# EAGLE design output_stage (EAGLE 6.5.0)
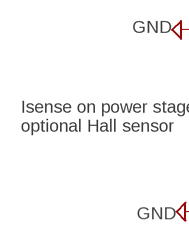
[diagram p0: schematic, sheet 1, part 1 of 2]
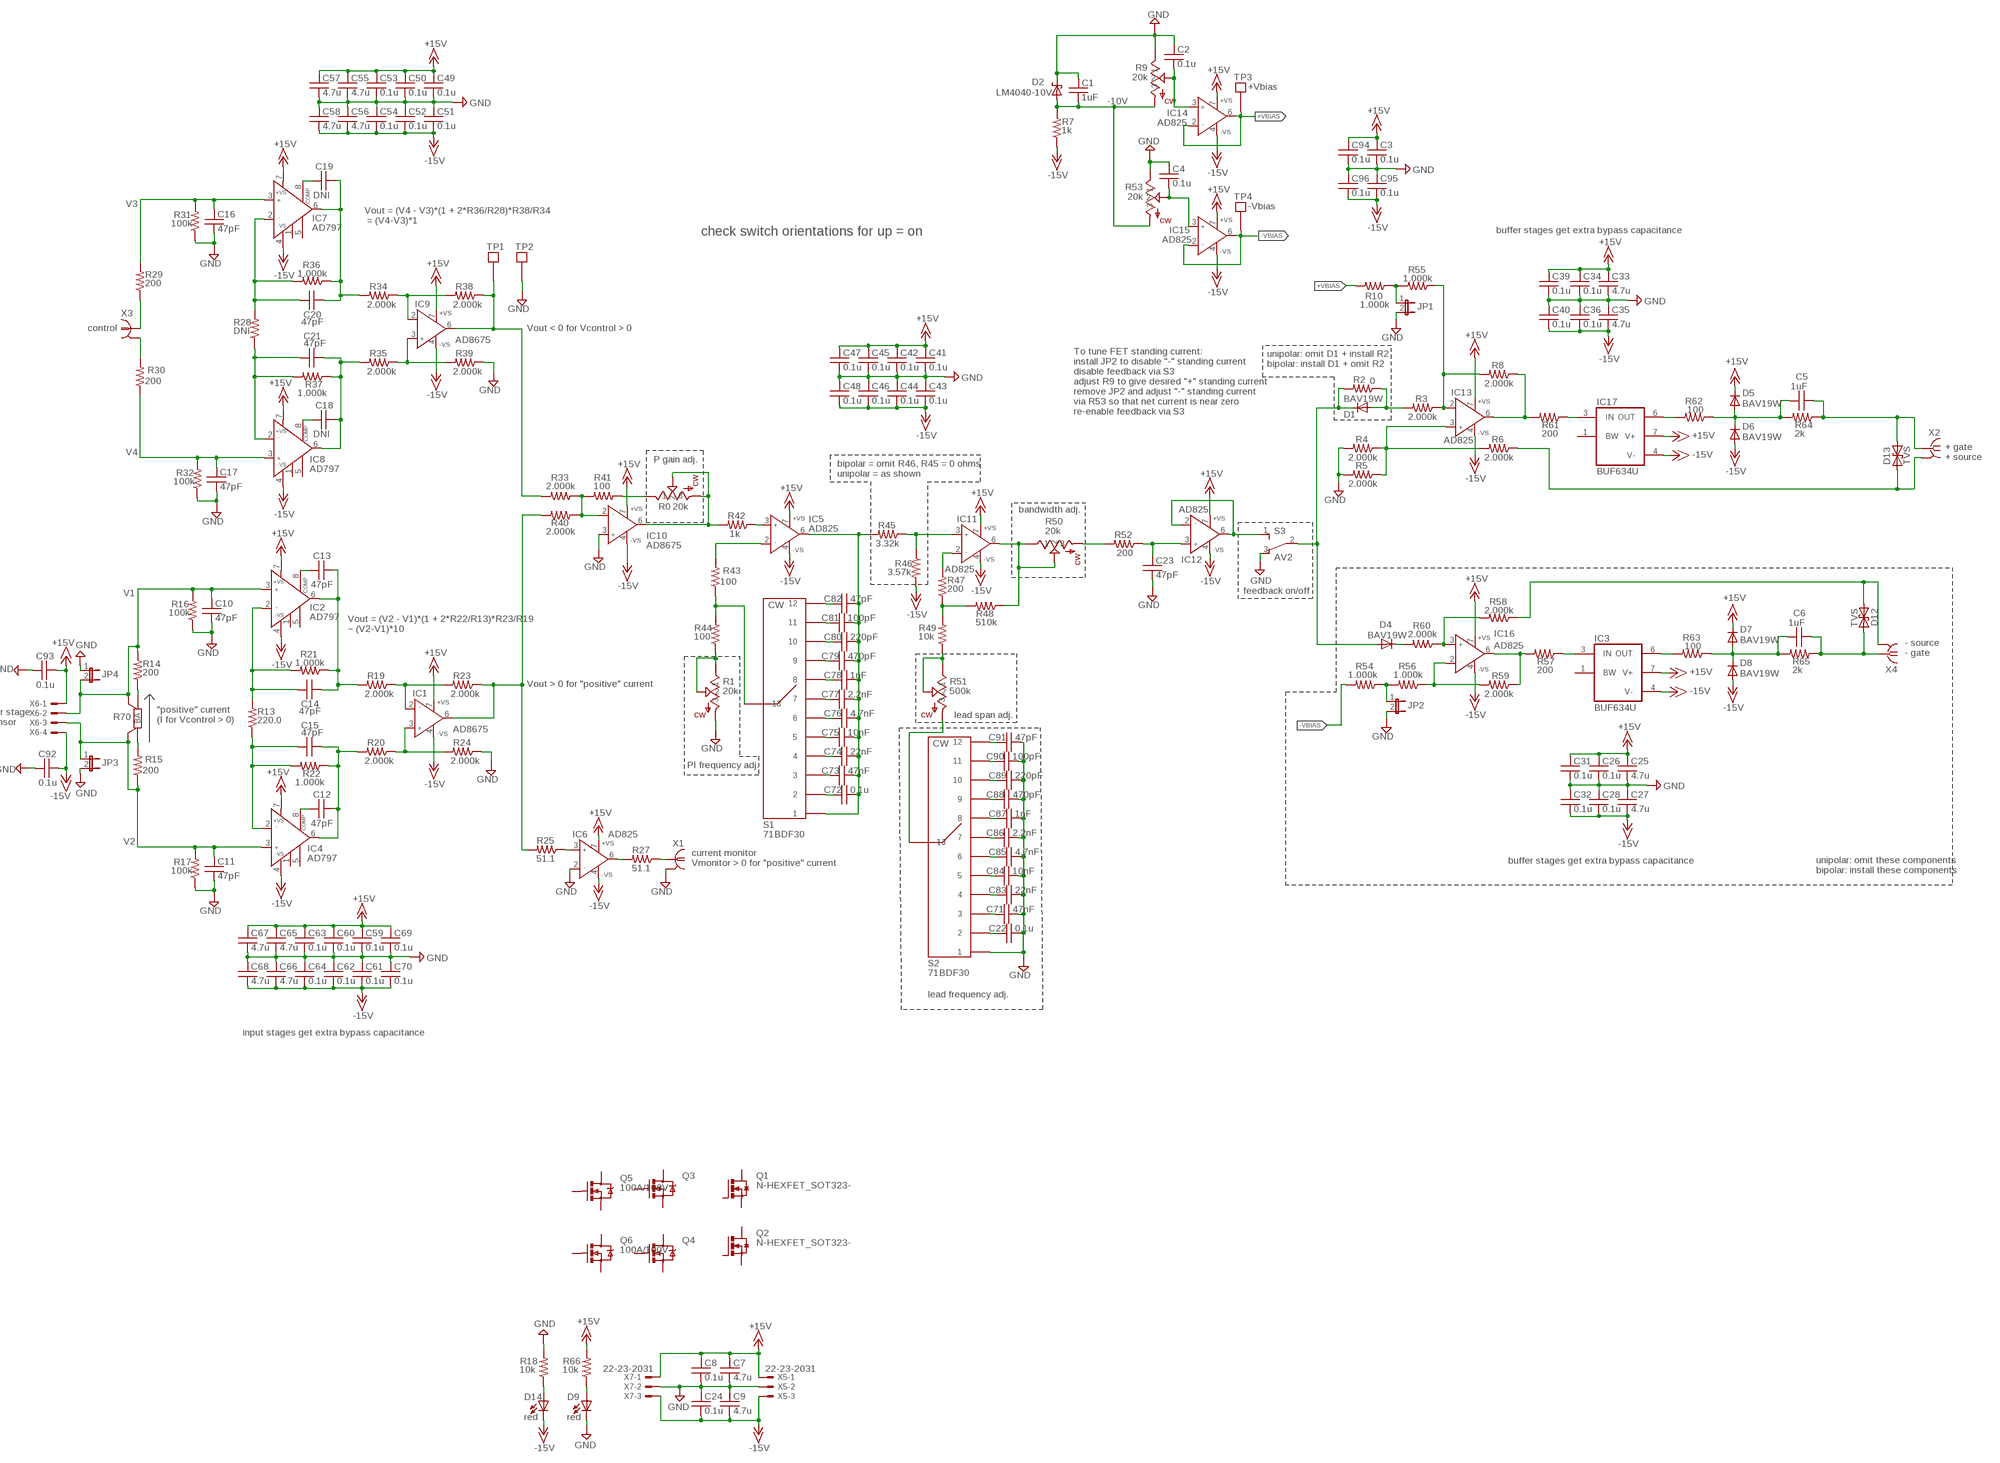
[diagram p1: schematic, sheet 1, part 2 of 2]

## Parts
C1  1uF  C0603  [0603]
C2  0.1u  C0603  [0603]
C3  0.1u  C0603  [0603]
C4  0.1u  C0603  [0603]
C5  1uF  C0603  [0603]
C6  1uF  C0603  [0603]
C7  4.7u  C0603  [0603]
C8  0.1u  C0603  [0603]
C9  4.7u  C0603  [0603]
C10  47pF  C0603  [0603]
C11  47pF  C0603  [0603]
C12  47pF  C0603  [0603]
C13  47pF  C0603  [0603]
C14  47pF  C0603  [0603]
C15  47pF  C0603  [0603]
C16  47pF  C0603  [0603]
C17  47pF  C0603  [0603]
C18  DNI  C0603  [0603]
C19  DNI  C0603  [0603]
C20  47pF  C0603  [0603]
C21  47pF  C0603  [0603]
C22  0.1u  C0603  [0603]
C23  47pF  C0603  [0603]
C24  0.1u  C0603  [0603]
C25  4.7u  C0603  [0603]
C26  0.1u  C0603  [0603]
C27  4.7u  C0603  [0603]
C28  0.1u  C0603  [0603]
C31  0.1u  C0603  [0603]
C32  0.1u  C0603  [0603]
C33  4.7u  C0603  [0603]
C34  0.1u  C0603  [0603]
C35  4.7u  C0603  [0603]
C36  0.1u  C0603  [0603]
C39  0.1u  C0603  [0603]
C40  0.1u  C0603  [0603]
C41  0.1u  C0603  [0603]
C42  0.1u  C0603  [0603]
C43  0.1u  C0603  [0603]
C44  0.1u  C0603  [0603]
C45  0.1u  C0603  [0603]
C46  0.1u  C0603  [0603]
C47  0.1u  C0603  [0603]
C48  0.1u  C0603  [0603]
C49  0.1u  C0603  [0603]
C50  0.1u  C0603  [0603]
C51  0.1u  C0603  [0603]
C52  0.1u  C0603  [0603]
C53  0.1u  C0603  [0603]
C54  0.1u  C0603  [0603]
C55  4.7u  C0603  [0603]
C56  4.7u  C0603  [0603]
C57  4.7u  C0603  [0603]
C58  4.7u  C0603  [0603]
C59  0.1u  C0603  [0603]
C60  0.1u  C0603  [0603]
C61  0.1u  C0603  [0603]
C62  0.1u  C0603  [0603]
C63  0.1u  C0603  [0603]
C64  0.1u  C0603  [0603]
C65  4.7u  C0603  [0603]
C66  4.7u  C0603  [0603]
C67  4.7u  C0603  [0603]
C68  4.7u  C0603  [0603]
C69  0.1u  C0603  [0603]
C70  0.1u  C0603  [0603]
C71  47nF  C0603  [0603]
C72  0.1u  C0603  [0603]
C73  47nF  C0603  [0603]
C74  22nF  C0603  [0603]
C75  10nF  C0603  [0603]
C76  4.7nF  C0603  [0603]
C77  2.2nF  C0603  [0603]
C78  1nF  C0603  [0603]
C79  470pF  C0603  [0603]
C80  220pF  C0603  [0603]
C81  100pF  C0603  [0603]
C82  47pF  C0603  [0603]
C83  22nF  C0603  [0603]
C84  10nF  C0603  [0603]
C85  4.7nF  C0603  [0603]
C86  2.2nF  C0603  [0603]
C87  1nF  C0603  [0603]
C88  470pF  C0603  [0603]
C89  220pF  C0603  [0603]
C90  100pF  C0603  [0603]
C91  47pF  C0603  [0603]
C92  0.1u  C0603  [0603]
C93  0.1u  C0603  [0603]
C94  0.1u  C0603  [0603]
C95  0.1u  C0603  [0603]
C96  0.1u  C0603  [0603]
D1  BAV19W  DIODE-SOD123  [SOD123]
D2  LM4040-10V  LM4040  [SOT23]
D4  BAV19W  DIODE-SOD123  [SOD123]
D5  BAV19W  DIODE-SOD123  [SOD123]
D6  BAV19W  DIODE-SOD123  [SOD123]
D7  BAV19W  DIODE-SOD123  [SOD123]
D8  BAV19W  DIODE-SOD123  [SOD123]
D9  red  LED0603  [LED0603]
D12  TVS  [SMA-DIODE]
D13  TVS  [SMA-DIODE]
D14  red  LED0603  [LED0603]
IC1  AD8675  AD825_BR  [SO8]
IC2  AD797  AD797_AR  [SO8]
IC3  BUF634U  [SO08]
IC4  AD797  AD797_BR  [SO8]
IC5  AD825  AD825_A  [SO08]
IC6  AD825  AD825_A  [SO08]
IC7  AD797  AD797_AR  [SO8]
IC8  AD797  AD797_BR  [SO8]
IC9  AD8675  AD825_BR  [SO8]
IC10  AD8675  AD825_BR  [SO8]
IC11  AD825  AD825_A  [SO08]
IC12  AD825  AD825_BR  [SO8]
IC13  AD825  AD825_BR  [SO8]
IC14  AD825  AD825_A  [SO08]
IC15  AD825  AD825_A  [SO08]
IC16  AD825  AD825_A  [SO08]
IC17  BUF634U  [SO08]
JP1  JP1E  [JP1]
JP2  JP1E  [JP1]
JP3  JP1E  [JP1]
JP4  JP1E  [JP1]
Q1  N-HEXFET_SOT323-  [SOT223]
Q2  N-HEXFET_SOT323-  [SOT223]
Q3  MOSFET-NCHANNELFDD8780  [DPAK]
Q4  MOSFET-NCHANNELFDD8780  [DPAK]
Q5  100A/100V  MOSFET-NCHANNELPSMN7R0  [TO-263/D2PAK]
Q6  100A/100V  MOSFET-NCHANNELPSMN7R0  [TO-263/D2PAK]
R0  20k  POT  [3590]
R1  20k  TRIM_US-B90P  [SP19L]
R2  0  R0603  [0603]
R3  2.000k  R0603  [0603]
R4  2.000k  R0603  [0603]
R5  2.000k  R0603  [0603]
R6  2.000k  R0603  [0603]
R7  1k  R0603  [0603]
R8  2.000k  R0603  [0603]
R9  20k  TRIM_US-B90P  [SP19L]
R10  1.000k  R0603  [0603]
R13  220.0  R0603  [0603]
R14  200  R0603  [0603]
R15  200  R0603  [0603]
R16  100k  R0603  [0603]
R17  100k  R0603  [0603]
R18  10k  R0603  [0603]
R19  2.000k  R0603  [0603]
R20  2.000k  R0603  [0603]
R21  1.000k  R0603  [0603]
R22  1.000k  R0603  [0603]
R23  2.000k  R0603  [0603]
R24  2.000k  R0603  [0603]
R25  51.1  R0603  [0603]
R27  51.1  R0603  [0603]
R28  DNI  R0603  [0603]
R29  200  R0603  [0603]
R30  200  R0603  [0603]
R31  100k  R0603  [0603]
R32  100k  R0603  [0603]
R33  2.000k  R0603  [0603]
R34  2.000k  R0603  [0603]
R35  2.000k  R0603  [0603]
R36  1.000k  R0603  [0603]
R37  1.000k  R0603  [0603]
R38  2.000k  R0603  [0603]
R39  2.000k  R0603  [0603]
R40  2.000k  R0603  [0603]
R41  100  R0603  [0603]
R42  1k  R0603  [0603]
R43  100  R0603  [0603]
R44  100  R0603  [0603]
R45  3.32k  R0603  [0603]
R46  3.57k  R0603  [0603]
R47  200  R0603  [0603]
R48  510k  R0603  [0603]
R49  10k  R0603  [0603]
R50  20k  TRIM_US-B90P  [SP19L]
R51  500k  TRIM_US-B90P  [SP19L]
R52  200  R0603  [0603]
R53  20k  TRIM_US-B90P  [SP19L]
R54  1.000k  R0603  [0603]
R55  1.000k  R0603  [0603]
R56  1.000k  R0603  [0603]
R57  200  R0603  [0603]
R58  2.000k  R0603  [0603]
R59  2.000k  R0603  [0603]
R60  2.000k  R0603  [0603]
R61  200  R0603  [0603]
R62  100  R0603  [0603]
R63  100  R0603  [0603]
R64  2k  R0603  [0603]
R65  2k  R0603  [0603]
R66  10k  R0603  [0603]
R70  RSENSE  [22-23-2041]
S1  71BDF30  [71BDF]
S2  71BDF30  [71BDF]
S3  AV2  SPDT  [SPDT-AV2]
TP1  TESTPOINT  [TESTPOINT]
TP2  TESTPOINT  [TESTPOINT]
TP3  TESTPOINT  [TESTPOINT]
TP4  TESTPOINT  [TESTPOINT]
X1  1-227161-0  [AMP_227161]
X2  BU-SMA-H  [BU-SMA-H]
X3  1-227161-0  [AMP_227161]
X4  BU-SMA-H  [BU-SMA-H]
X5  22-23-2031  [22-23-2031]
X6  22-23-2041  [22-23-2041]
X7  22-23-2031  [22-23-2031]

## Nets
+15V: C3.1 C7.1 C8.1 C25.1 C26.1 C31.1 C33.1 C34.1 C39.1 C41.1 C42.1 C45.1 C47.1 C49.1 C50.1 C53.1 C55.1 C57.1 C59.1 C60.1 C63.1 C65.1 C67.1 C69.1 C93.2 C94.1 D5.C D7.C IC1.7(+VS) IC2.7(+VS) IC3.7(V+) IC4.7(+VS) IC5.7(+VS) IC6.7(+VS) IC7.7(+VS) IC8.7(+VS) IC9.7(+VS) IC10.7(+VS) IC11.7(+VS) IC12.7(+VS) IC13.7(+VS) IC14.7(+VS) IC15.7(+VS) IC16.7(+VS) IC17.7(V+) R66.2 X5.1 X6.1 X7.1
+GATE: C5.2 D13.C R64.1 X2.1
+SOURCE: D13.A R6.1 X2.2 X2.3 X2.4 X2.5
+VBIAS: IC14.2(IN-) IC14.6(OUT) R10.2 TP3.P$1
-10V: C1.2 D2.2(A) R7.2 R9.E R53.E
-15V: C9.2 C24.2 C27.2 C28.2 C32.2 C35.2 C36.2 C40.2 C43.2 C44.2 C46.2 C48.2 C51.2 C52.2 C54.2 C56.2 C58.2 C61.2 C62.2 C64.2 C66.2 C68.2 C70.2 C92.2 C95.2 C96.2 D6.A D8.A D14.C IC1.4(-VS) IC2.4(-VS) IC3.4(V-) IC4.4(-VS) IC5.4(-VS) IC6.4(-VS) IC7.4(-VS) IC8.4(-VS) IC9.4(-VS) IC10.4(-VS) IC11.4(-VS) IC12.4(-VS) IC13.4(-VS) IC14.4(-VS) IC15.4(-VS) IC16.4(-VS) IC17.4(V-) R7.1 R46.2 X5.3 X6.4 X7.3
-GATE: C6.2 D12.C R65.1 X4.1
-SOURCE: D12.A R58.1 X4.2 X4.3 X4.4 X4.5
-VBIAS: IC15.2(IN-) IC15.6(OUT) R54.2 TP4.P$1
GND: C1.1 C2.1 C3.2 C4.1 C7.2 C8.2 C9.1 C10.2 C11.2 C16.2 C17.2 C22.2 C23.2 C24.1 C25.2 C26.2 C27.1 C28.1 C31.2 C32.1 C33.2 C34.2 C35.1 C36.1 C39.2 C40.1 C41.2 C42.2 C43.1 C44.1 C45.2 C46.1 C47.2 C48.1 C49.2 C50.2 C51.1 C52.1 C53.2 C54.1 C55.2 C56.1 C57.2 C58.1 C59.2 C60.2 C61.1 C62.1 C63.2 C64.1 C65.2 C66.1 C67.2 C68.1 C69.2 C70.1 C71.2 C83.2 C84.2 C85.2 C86.2 C87.2 C88.2 C89.2 C90.2 C91.2 C92.1 C93.1 C94.2 C95.1 C96.1 D2.1(C) D9.C IC6.2(IN-) IC10.3(IN+) JP1.2 JP2.2 JP3.2 JP4.1 R1.E R4.2 R5.2 R9.A R16.1 R17.1 R18.2 R24.1 R31.1 R32.1 R39.1 R53.A S2.1 S3.3 TP2.P$1 X1.2 X5.2 X7.2
N$1: R1.A R1.S R44.1
N$2: D1.A R2.1 R3.2
N$3: JP1.1 R10.1 R55.2
N$4: D4.C R60.2
N$5: IC13.3(IN+) R4.1 R5.1 R6.2
N$7: C14.1 IC2.2(IN-) R13.2 R21.2
N$8: R14.1 R70.1(A)
N$9: IC13.2(IN-) R3.1 R8.2 R55.1
N$12: C2.2 IC14.3(IN+) R9.S
N$13: R15.2 R70.4(B)
N$15: C15.1 IC4.2(IN-) R13.1 R22.2
N$16: C12.1 IC4.8(COMP)
N$17: C12.2 C15.2 IC4.6(OUT) R20.2 R22.1
N$18: C13.1 IC2.8(COMP)
N$19: C13.2 C14.2 IC2.6(OUT) R19.2 R21.1
N$20: IC1.2(IN-) R19.1 R23.2
N$21: IC1.3(IN+) R20.1 R24.2
N$22: IC1.6(OUT) R23.1 R25.2 R40.2
N$23: IC6.3(IN+) R25.1
N$24: IC6.6(OUT) R27.2
N$25: R27.1 X1.1
N$26: C20.1 IC7.2(IN-) R28.2 R36.2
N$27: C16.1 IC7.3(IN+) R29.2 R31.2
N$28: C17.1 IC8.3(IN+) R30.1 R32.2
N$29: R29.1 X3.1
N$30: R30.2 X3.2
N$31: C21.1 IC8.2(IN-) R28.1 R37.2
N$32: C18.1 IC8.8(COMP)
N$33: C18.2 C21.2 IC8.6(OUT) R35.2 R37.1
N$34: C19.1 IC7.8(COMP)
N$35: C19.2 C20.2 IC7.6(OUT) R34.2 R36.1
N$36: IC9.2(IN-) R34.1 R38.2
N$37: IC9.3(IN+) R35.1 R39.2
N$38: IC9.6(OUT) R33.2 R38.1 TP1.P$1
N$39: IC10.2(IN-) R33.1 R40.1 R41.2
N$40: IC11.3(IN+) R45.1 R46.1
N$41: IC10.6(OUT) R0.2 R0.3 R42.2
N$42: IC5.3(IN+) R42.1
N$43: IC5.2(IN-) R43.2
N$44: R43.1 R44.2 S1.13
N$45: R51.E S2.13
N$46: IC11.2(IN-) R47.2
N$47: R47.1 R48.2 R49.2
N$48: IC11.6(OUT) R48.1 R50.A R50.S
N$50: R49.1 R51.A R51.S
N$51: R50.E R52.2
N$52: C23.1 IC12.3(IN+) R52.1
N$53: IC12.2(IN-) IC12.6(OUT) S3.1
N$54: D1.C D4.A R2.2 S3.2
N$57: C4.2 IC15.3(IN+) R53.S
N$59: JP2.1 R54.1 R56.2
N$60: IC16.2(IN-) R56.1 R59.2
N$61: IC16.3(IN+) R58.2 R60.1
N$62: IC16.6(OUT) R57.2 R59.1
N$63: D9.A R66.1
N$64: IC3.3(IN) R57.1
N$65: IC17.3(IN) R61.1
N$66: IC13.6(OUT) R8.1 R61.2
N$68: IC17.6(OUT) R62.2
N$69: IC3.6(OUT) R63.2
N$70: C5.1 D5.A D6.C R62.1 R64.2
N$73: C6.1 D7.A D8.C R63.1 R65.2
N$77: D14.A R18.1
N$78: C72.2 C73.2 C74.2 C75.2 C76.2 C77.2 C78.2 C79.2 C80.2 C81.2 C82.2 IC5.6(OUT) R45.2 S1.1
N$79: C72.1 S1.2
N$80: C73.1 S1.3
N$81: C74.1 S1.4
N$82: R0.1 R41.1
N$83: C75.1 S1.5
N$84: C76.1 S1.6
N$85: C77.1 S1.7
N$86: C78.1 S1.8
N$87: C79.1 S1.9
N$88: C80.1 S1.10
N$89: C81.1 S1.11
N$90: C82.1 S1.12
N$91: C22.1 S2.2
N$92: C71.1 S2.3
N$93: C83.1 S2.4
N$94: C84.1 S2.5
N$95: C85.1 S2.6
N$96: C86.1 S2.7
N$97: C87.1 S2.8
N$98: C88.1 S2.9
N$99: C89.1 S2.10
N$100: C90.1 S2.11
N$101: C91.1 S2.12
V+: C11.1 IC4.3(IN+) JP3.1 R15.1 R17.2 R70.3(SB) X6.3
V-: C10.1 IC2.3(IN+) JP4.2 R14.2 R16.2 R70.2(SA) X6.2
Unconnected: IC2.1(OFF) IC2.5(OFF) IC3.1(BW) IC4.1(OFF) IC4.5(OFF) IC7.1(OFF) IC7.5(OFF) IC8.1(OFF) IC8.5(OFF) IC17.1(BW) Q1.1(G) Q1.3(S) Q1.4(D) Q2.1(G) Q2.3(S) Q2.4(D) Q3.1(G) Q3.3(S) Q3.4(D) Q4.1(G) Q4.3(S) Q4.4(D) Q5.1(G) Q5.2(D) Q5.3(S) Q6.1(G) Q6.2(D) Q6.3(S)

## Notes on the sheet
- +Vbias
- -10V
- V3 | -Vbias
- Vout = (V4 - V3)*(1 + 2*R36/R28)*R38/R34 
   = (V4-V3)*1
- check switch orientations for up = on | buffer stages get extra bypass capacitance
- control | Vout < 0 for Vcontrol > 0
- unipolar: omit D1 + install R2
  bipolar: install D1 + omit R2
- To tune FET standing current:
  install JP2 to disable "-" standing current
  disable feedback via S3
  adjust R9 to give desired "+" standing current
  remove JP2 and adjust "-" standing current 
  via R53 so that net current is near zero
  re-enable feedback via S3
- V4
- + gate
  + source
- P gain adj.
- bipolar = omit R46, R45 = 0 ohms
  unipolar = as shown
- bandwidth adj.
- V1 | feedback on/off
- Vout = (V2 - V1)*(1 + 2*R22/R13)*R23/R19 
  ~ (V2-V1)*10
- - source
  - gate
- Vout > 0 for "positive" current
- lead span adj.
- "positive" current 
  (I for Vcontrol > 0)
- Isense on power stage
  optional Hall sensor
- PI frequency adj.
- V2
- buffer stages get extra bypass capacitance
- current monitor
  Vmonitor > 0 for "positive" current
- unipolar: omit these components
  bipolar: install these components
- lead frequency adj.
- input stages get extra bypass capacitance

## Library data of the parts
C1-C28 C31-C36 C39-C96 = acrooptics:C: Capacitor
D1 D4-D8 = AquariumLibrary:DIODE-: DIODE
D2 = noah:LM4040: LM4040 Reference Zener Diode
D9 D14 = acrooptics:LED: LED OSRAM: - CHIPLED LG R971, LG N971, LY N971, LG Q971, LY Q971, LO R971, LY R971 LH N974, LH R974 LS Q976, LO Q976, LY Q976 LO Q996 - Hyper CHIPLED LW Q18S LB Q993, LB Q99A, LB R99A - SideLED LS A670, LO A670, LY A670, LG A670, LP A670 LB A673, LV A673, LT A673, LW A673 LH A674 LY A675 LS A676, LA A676, LO A676, LY A676, LW A676 LS A679, LY A679, LG A679 - Hyper Micro SIDELED® LS Y876, LA Y876, LO Y876, LY Y876 LT Y87S - SmartLED LW L88C, LW L88S LB L89C, LB L89S, LG L890 LS L89K, LO L89K, LY L89K LS L896, LA L896, LO L896, LY L896 - TOPLED LS T670, LO T670, LY T670, LG T670, LP T670 LSG T670, LSP T670, LSY T670, LOP T670, LYG T670 LG T671, LOG T671, LSG T671 LB T673, LV T673, LT T673, LW T673 LH T674 LS T676, LA T676, LO T676, LY T676, LB T676, LH T676, LSB T676, LW T676 LB T67C, LV T67C, LT T67C, LS T67K, LO T67K, LY T67K, LW E67C LS E67B, LA E67B, LO E67B, LY E67B, LB E67C, LV E67C, LT E67C LW T67C LS T679, LY T679, LG T679 LS T770, LO T770, LY T770, LG T770, LP T770 LB T773, LV T773, LT T773, LW T773 LH T774 LS E675, LA E675, LY E675, LS T675 LS T776, LA T776, LO T776, LY T776, LB T776 LHGB T686 LT T68C, LB T68C - Hyper Mini TOPLED® LB M676 - Mini TOPLED Santana® LG M470 LS M47K, LO M47K, LY M47K Source: http://www.osram.convergy.de LUXEON: - LUMILED® LXK2-PW12-R00, LXK2-PW12-S00, LXK2-PW14-U00, LXK2-PW14-V00 LXK2-PM12-R00, LXK2-PM12-S00, LXK2-PM14-U00 LXK2-PE12-Q00, LXK2-PE12-R00, LXK2-PE12-S00, LXK2-PE14-T00, LXK2-PE14-U00 LXK2-PB12-K00, LXK2-PB12-L00, LXK2-PB12-M00, LXK2-PB14-N00, LXK2-PB14-P00, LXK2-PB14-Q00 LXK2-PR12-L00, LXK2-PR12-M00, LXK2-PR14-Q00, LXK2-PR14-R00 LXK2-PD12-Q00, LXK2-PD12-R00, LXK2-PD12-S00 LXK2-PH12-R00, LXK2-PH12-S00 LXK2-PL12-P00, LXK2-PL12-Q00, LXK2-PL12-R00 Source: www.luxeon.com KINGBRIGHT: KA-3528ASYC Source: www.kingbright.com
D12 D13 = SparkFun:TVS
IC1 IC9 IC10 IC12 IC13 = noah:AD825_B: Low Cost, General-Purpose High Speed JFET Amplifier Source: http://www.analog.com/static/imported-files/data_sheets/AD825.pdf; MF: ALTERA CORPORATION; MPN: AD825ARZ; OC_FARNELL: 9603735; OC_NEWARK: 59K6528
IC2 IC7 = noah:AD797_A: Ultralow Distortion, Ultralow Noise Op Amp Source: http://www.analog.com/static/imported-files/data_sheets/AD797.pdf; MF: ALTERA CORPORATION; MPN: AD797ARZ; OC_FARNELL: 9426450; OC_NEWARK: 88H0085
IC3 IC17 = burr-brown:BUF634: 250mA High-Speed Buffer; MF: TEXAS INSTRUMENTS; MPN: BUF634U; OC_FARNELL: 4733617; OC_NEWARK: 27C6567
IC4 IC8 = noah:AD797_B: Ultralow Distortion, Ultralow Noise Op Amp Source: http://www.analog.com/static/imported-files/data_sheets/AD797.pdf; MF: ALTERA CORPORATION; MPN: AD797ARZ; OC_FARNELL: 9426450; OC_NEWARK: 88H0085
IC5 IC6 IC11 IC14-IC16 = noah:AD825_A: Low Cost, General-Purpose High Speed JFET Amplifier Source: http://www.analog.com/static/imported-files/data_sheets/AD825.pdf
JP1-JP4 = jumper:JP1E: JUMPER
Q1 Q2 = transistor-power:N-HEXFET_?-*: HEXFET® Power MOSFET
Q3 Q4 = WCSMain:MOSFET-NCHANNEL: Common NMOSFET Parts MFG P/N Store ID Prod ID FDD8780 TRANS-09984 SI7820DN TRANS-11055 FDS6630A IC-08089 2N7002PW TRANS-11151 FQP30N06L COM-10213 TRANS-10060 BSS123LT1G TRANS-08345 BSS138 TRANS-00830 BS170 2N7000; PROD_ID: TRANS-09984
Q5 Q6 = WCSMain:MOSFET-NCHANNEL: Common NMOSFET Parts MFG P/N Store ID Prod ID FDD8780 TRANS-09984 SI7820DN TRANS-11055 FDS6630A IC-08089 2N7002PW TRANS-11151 FQP30N06L COM-10213 TRANS-10060 BSS123LT1G TRANS-08345 BSS138 TRANS-00830 BS170 2N7000; PROD_ID: TRANS-12437
R0 = Fitch:POT
R1 R9 R50 R51 R53 = Fitch:TRIM_US-: POTENTIOMETER
R2-R8 R10 R13-R25 R27-R49 R52 R54-R66 = acrooptics:R: 0603 resistor
R70 = noah:RSENSE: SMD SHUNT RESISTOR
S1 S2 = noah:71BDF30: Grayhill 71 series rotary switch, BD style. DK part number GH7107
S3 = noah:SPDT
TP1-TP4 = Fitch:TESTPOINT
X1 X3 = con-coax:?227161*: JACK, RIGHT ANGLE, 50 OHM, PCB, BNC Source: amp_227161.pdf; MF: TYCO ELECTRONICS; MPN: 1-227161; OC_FARNELL: unknown; OC_NEWARK: 33B3200
X2 X4 = con-coax:BU-SMA-H: FEMALE SMA CONNECTOR Radiall; OC_FARNELL: unknown; OC_NEWARK: unknown
X5 X7 = con-molex:22-23-2031: .100" (2.54mm) Center Header - 3 Pin; MF: MOLEX; MPN: 22-23-2031; OC_FARNELL: 1462950; OC_NEWARK: 30C0862
X6 = con-molex:22-23-2041: .100" (2.54mm) Center Header - 4 Pin; MF: MOLEX; MPN: 22-23-2041; OC_FARNELL: 1462920; OC_NEWARK: 38C0355

## Net classes
1 standard: width 0.61 mm, clearance 0.254 mm

## Board
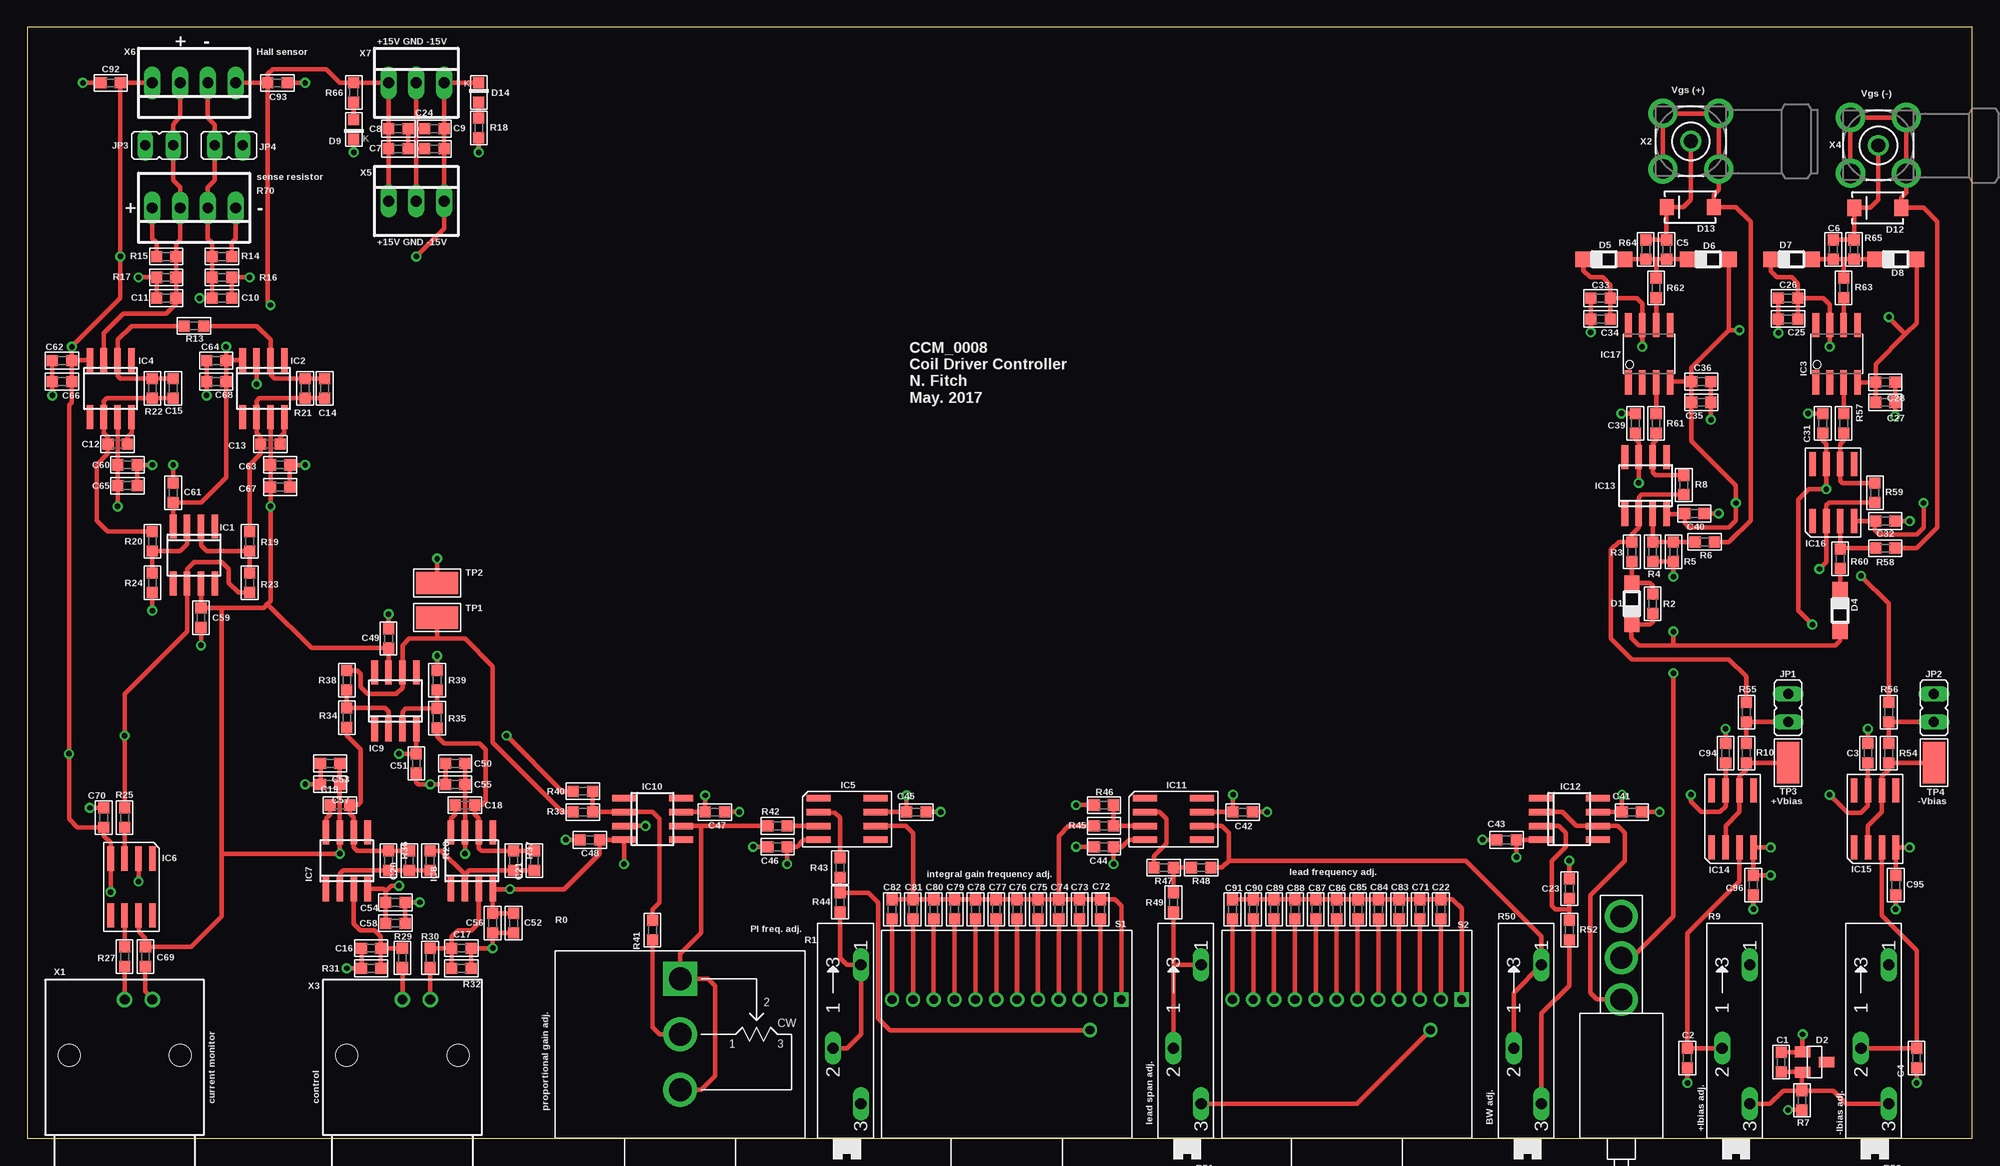
[diagram p2: board, top side]
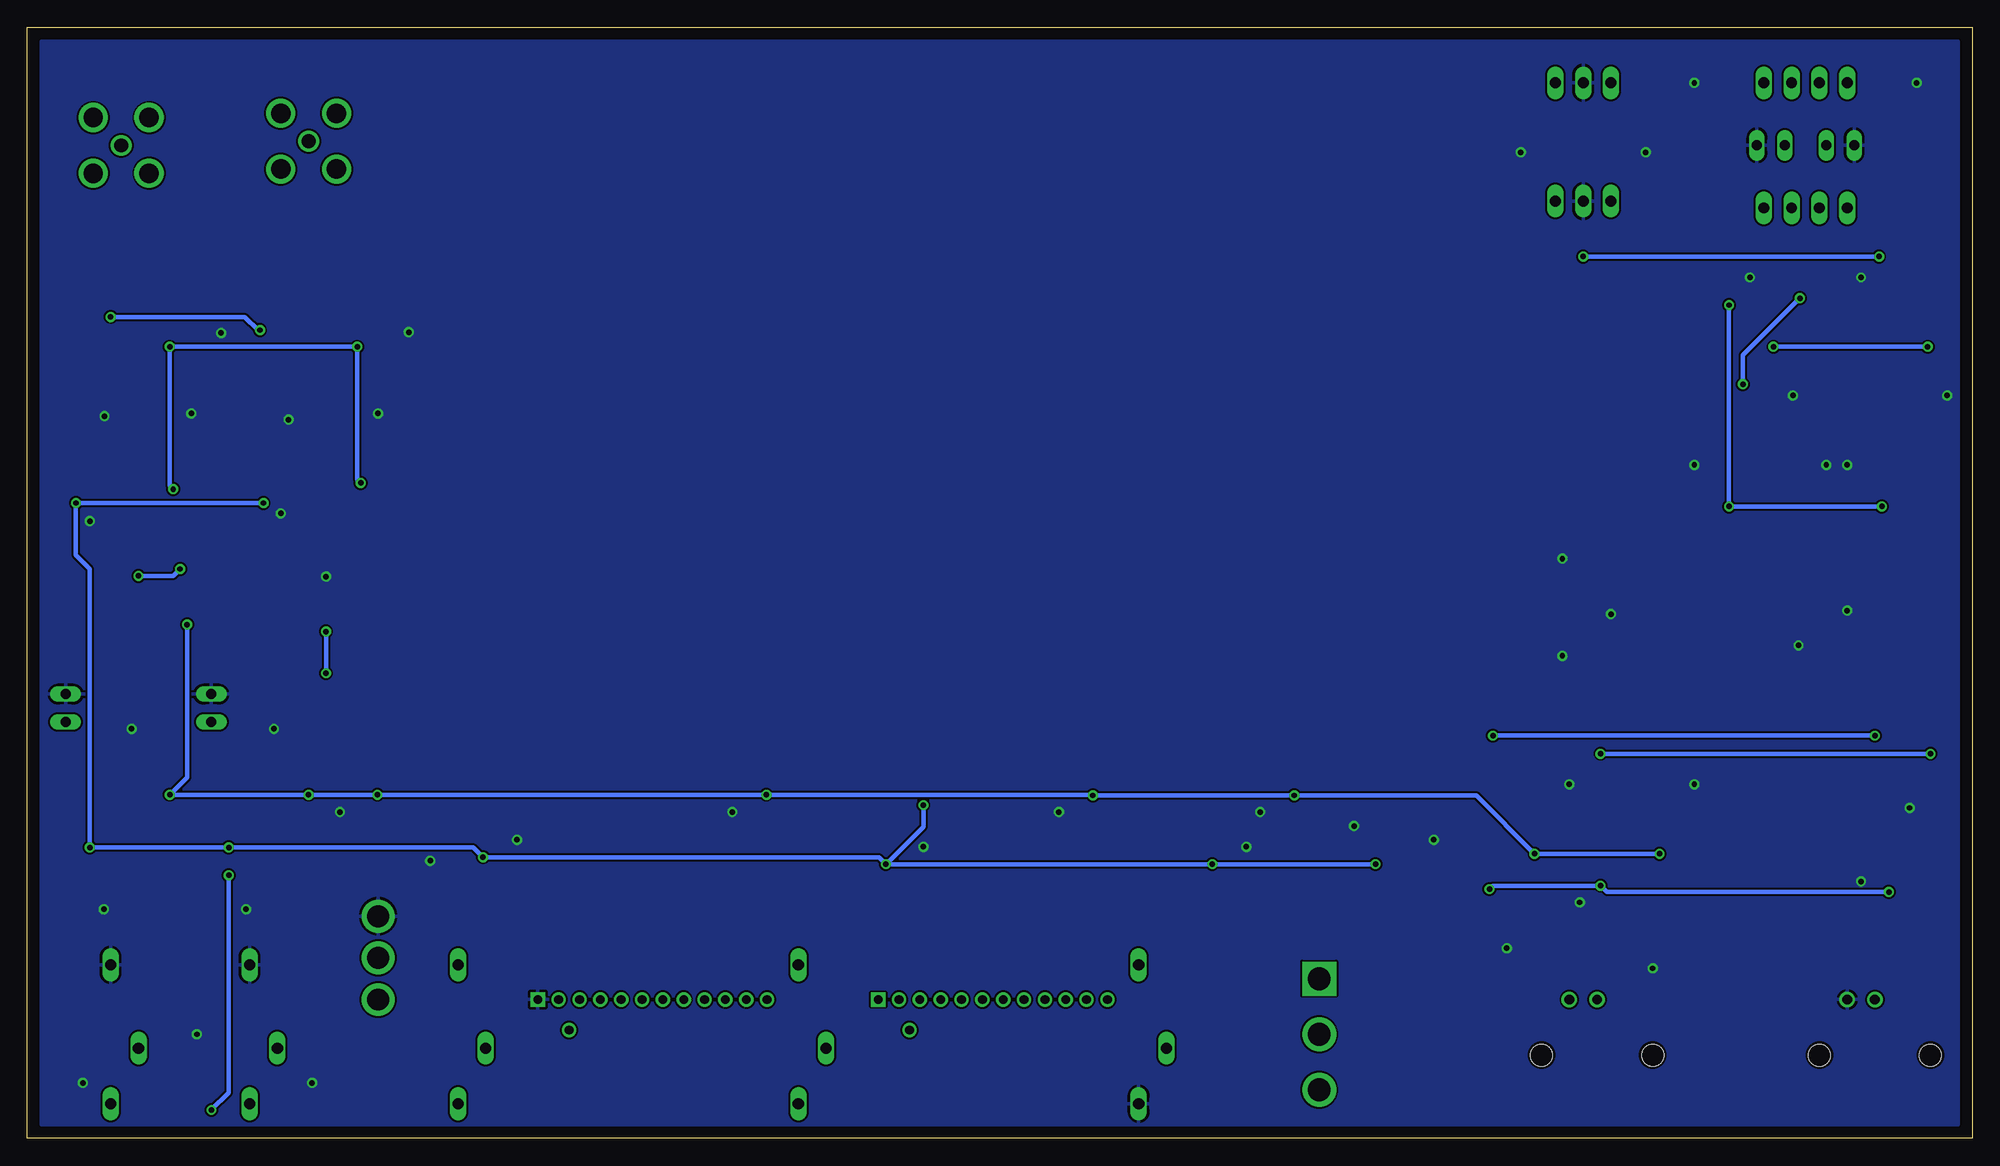
[diagram p3: board, bottom side, seen from below]

Size 177.8 x 101.6 mm. Coordinates in mm from the lower left corner, seen from the top.
Outline: 0,0 177.8,0 177.8,101.6 0,101.6 0,0
Copper layers (1*16): Top 0.035mm / dielectric 1.5mm / Bottom 0.035mm
Design rules "default *": minimum track width 10mil, minimum drill 10mil, track to track 7mil, track to pad 7mil, pad to pad 7mil, via to via 7mil, smd to smd 7mil, copper to edge 10mil, drill to drill 8mil, minimum pad ring 10mil, minimum via ring 8mil, stop-mask expansion 4mil, vias tented up to drill 0mil, thermal gap 10mil

### Footprints (pad centres in the part's own frame; a part is rotated, then mirrored left to right if it is on the bottom)
0603 = smd 1.016 x 1.016: 1 -0.889,0; 2 0.889,0
SOD123 = smd 1.4 x 1.4: A 1.9,0; C -1.9,0
SOT23 = smd 1 x 1.4: 1 -0.95,-1.1; 2 0.95,-1.1; 3 0,1.1
LED0603 = smd 1.016 x 1.016: A 0,-0.889; C 0,0.889
SMA-DIODE = smd 1.27 x 1.47: A -2.15,0; C 2.15,0
SO8 = smd 0.6 x 2.2: 1 -1.905,-2.6; 2 -0.635,-2.6; 3 0.635,-2.6; 4 1.905,-2.6; 5 1.905,2.6; 6 0.635,2.6; 7 -0.635,2.6; 8 -1.905,2.6
SO08 = smd 0.61 x 2.21: 1 -1.905,-2.616; 2 -0.635,-2.616; 3 0.635,-2.616; 4 1.905,-2.616; 5 1.905,2.616; 6 0.635,2.616; 7 -0.635,2.616; 8 -1.905,2.616
SO08' = smd 0.6 x 2.2: 1 -1.905,-2.6; 2 -0.635,-2.6; 3 0.635,-2.6; 4 1.905,-2.6; 5 1.905,2.6; 6 0.635,2.6; 7 -0.635,2.6; 8 -1.905,2.6
JP1 = drill 0.914 long: 1 0,-1.27; 2 0,1.27
SOT223 = smd 1.219 x 2.235: 1 -2.311,-3.099; 2 0,-3.099; 3 2.311,-3.099 | smd 3.6 x 2.2: 4 0,3.099
DPAK = smd 1.6 x 3: 1 -2.28,-5.31; 3 2.28,-5.31 | smd 4.826 x 5.715: 4 0,1.588
TO-263/D2PAK = smd 2.32 x 3.81: 1 -2.54,-7.045; 3 2.54,-7.045 | smd 11 x 9.65: 2 0,4.125
3590 = drill 2.083: 1 0,0; 3 0,-5.08 | drill 2.083 square: 2 0,5.08
SP19L = drill 1.016 long: A 5.715,-1.27; E -6.985,-1.27; S -1.905,1.27
22-23-2041 = drill 1 long: 1 -3.81,0; 2 -1.27,0; 3 1.27,0; 4 3.81,0
71BDF = drill 0.8 square: 1 10.477,0 | drill 0.8: 2 8.572,0; 3 6.668,0; 4 4.763,0; 5 2.857,0; 6 0.953,0; 7 -0.953,0; 8 -2.857,0; 9 -4.763,0; 10 -6.668,0; 11 -8.572,0; 12 -10.477,0; 13 7.62,-2.794
SPDT-AV2 = drill 2: 1 0,0; 2 0,3.81; 3 0,7.62
TESTPOINT = smd 3.81 x 2.032: P$1 0,0
AMP_227161 = drill 0.9 pad 1.27: 1 0,-5.08; 2 -2.54,-5.08 | hole 2: -5.08,0; 5.08,0
BU-SMA-H = drill 1.27: 1 0,0 | drill 1.778: 2 -2.55,2.55; 3 2.55,2.55; 4 2.55,-2.55; 5 -2.55,-2.55
22-23-2031 = drill 1 long: 1 -2.54,0; 2 0,0; 3 2.54,0

### Placement (x,y rotation side)
C1  160.34,6.99 270 top
C2  151.76,7.37 90 top
C3  168.28,35.24 90 top
C4  172.72,7.37 90 top
C5  149.86,81.28 90 top
C6  167,81.28 90 top
C7  33.91,90.49 0 top
C8  33.91,92.33 0 top
C9  37.21,90.49 0 top
C10  17.78,76.83 0 top
C11  12.7,76.83 180 top
C12  8.26,63.5 180 top
C13  22.23,63.5 180 top
C14  27.18,68.58 270 top
C15  13.34,68.58 270 top
C16  31.43,17.4 180 top
C17  39.69,17.4 0 top
C18  40.01,30.48 0 top
C19  28.57,30.48 0 top
C20  34.92,25.4 90 top
C21  46.35,25.4 90 top
C22  129.22,20.95 90 top
C23  140.97,22.86 90 top
C24  37.21,92.33 0 top
C25  160.97,74.93 180 top
C26  160.97,76.83 180 top
C27  169.86,67.31 180 top
C28  169.86,69.15 180 top
C31  164.15,65.41 90 top
C32  169.86,56.45 180 top
C33  143.83,76.83 180 top
C34  143.83,74.93 180 top
C35  153.03,67.31 180 top
C36  153.03,69.22 180 top
C39  147,65.41 90 top
C40  152.4,57.15 180 top
C41  146.69,29.84 0 top
C42  111.12,29.84 0 top
C43  135.25,27.3 0 top
C44  98.42,26.67 0 top
C45  81.28,29.84 0 top
C46  68.58,26.67 0 top
C47  62.87,29.84 0 top
C48  51.44,27.3 0 top
C49  33.02,45.72 90 top
C50  39.12,34.29 180 top
C51  35.56,34.29 90 top
C52  44.45,19.68 90 top
C53  27.69,34.29 180 top
C54  33.66,21.59 180 top
C55  39.12,32.38 180 top
C56  42.55,19.68 90 top
C57  27.69,32.38 180 top
C58  33.66,19.68 180 top
C59  15.88,47.62 270 top
C60  9.14,61.59 0 top
C61  13.34,59.05 270 top
C62  3.17,71.12 0 top
C63  23.11,61.59 0 top
C64  17.27,71.12 0 top
C65  9.14,59.69 0 top
C66  3.17,69.22 0 top
C67  23.11,59.56 0 top
C68  17.27,69.22 0 top
C69  10.79,16.64 270 top
C70  6.99,29.34 270 top
C71  127.32,20.95 90 top
C72  98.11,20.95 90 top
C73  96.2,20.95 90 top
C74  94.3,20.95 90 top
C75  92.39,20.95 90 top
C76  90.49,20.95 90 top
C77  88.58,20.95 90 top
C78  86.68,20.95 90 top
C79  84.77,20.95 90 top
C80  82.87,20.95 90 top
C81  80.96,20.95 90 top
C82  79.06,20.95 90 top
C83  125.41,20.95 90 top
C84  123.51,20.95 90 top
C85  121.67,20.95 90 top
C86  119.7,20.95 90 top
C87  117.79,20.95 90 top
C88  115.89,20.95 90 top
C89  113.98,20.95 90 top
C90  112.08,20.95 90 top
C91  110.17,20.95 90 top
C92  7.62,96.52 0 top
C93  22.86,96.52 180 top
C94  155.26,35.24 90 top
C95  170.81,23.18 90 top
C96  157.8,23.18 90 top
D1  146.69,48.9 90 top
D2  163.39,6.99 270 top
D4  165.74,48.26 270 top
D5  144.15,80.39 0 top
D6  153.67,80.39 0 top
D7  161.29,80.39 0 top
D8  170.81,80.39 0 top
D9  29.84,92.27 180 top
D12  169.16,85.09 180 top
D13  152.02,85.15 180 top
D14  41.27,95.63 0 top
IC1  15.24,53.34 180 top
IC2  21.59,68.58 180 top
IC3  165.42,71.75 0 top
IC4  7.62,68.58 180 top
IC5  AD825  [SO08']  74.93,29.21 270 top
IC6  AD825  [SO08']  9.53,22.99 180 top
IC7  29.21,25.4 0 top
IC8  40.64,25.4 0 top
IC9  33.66,40.01 0 top
IC10  57.15,29.21 270 top
IC11  AD825  [SO08']  104.78,29.21 270 top
IC12  140.97,29.21 270 top
IC13  147.96,59.69 0 top
IC14  AD825  [SO08']  155.89,29.21 0 top
IC15  AD825  [SO08']  168.91,29.21 0 top
IC16  AD825  [SO08']  165.1,59.05 0 top
IC17  148.27,71.75 0 top
JP1  160.97,39.37 0 top
JP2  174.31,39.37 0 top
JP3  12.06,90.81 90 top
JP4  18.41,90.81 90 top
Q1  -5.02,-16.51 0 top  (outside the outline)
Q2  -13.34,-16.51 0 top  (outside the outline)
Q3  -21.34,-14.1 0 top  (outside the outline)
Q4  -30.04,-14.1 0 top  (outside the outline)
Q5  -39.88,-11.94 0 top  (outside the outline)
Q6  -51.12,-11.94 0 top  (outside the outline)
R0  59.69,9.53 0 top
R1  74.93,10.16 90 top
R2  148.59,48.9 270 top
R3  146.69,53.66 270 top
R4  148.59,53.66 270 top
R5  150.5,53.66 270 top
R6  153.35,54.55 180 top
R7  162.24,3.49 90 top
R8  151.45,59.75 270 top
R9  156.21,10.16 90 top
R10  157.16,35.24 270 top
R13  15.24,74.3 0 top
R14  17.78,80.64 180 top
R15  12.7,80.64 180 top
R16  17.78,78.74 180 top
R17  12.7,78.74 0 top
R18  41.27,92.39 270 top
R19  20.32,54.61 90 top
R20  11.43,54.61 90 top
R21  25.4,68.58 90 top
R22  11.43,68.58 90 top
R23  20.32,50.8 90 top
R24  11.43,50.8 90 top
R25  8.89,29.34 90 top
R27  8.89,16.64 90 top
R28  36.83,25.4 270 top
R29  34.29,16.51 90 top
R30  36.83,16.51 270 top
R31  31.43,15.56 0 top
R32  39.69,15.56 180 top
R33  50.8,29.84 180 top
R34  29.21,38.48 270 top
R35  37.47,38.42 270 top
R36  33.02,25.4 270 top
R37  44.45,25.4 270 top
R38  29.21,41.91 270 top
R39  37.47,41.91 270 top
R40  50.8,31.75 180 top
R41  57.15,19.05 90 top
R42  68.58,28.57 180 top
R43  74.3,24.77 90 top
R44  74.3,21.59 90 top
R45  98.42,28.57 180 top
R46  98.42,30.48 180 top
R47  103.89,24.77 180 top
R48  107.31,24.77 180 top
R49  104.78,21.59 90 top
R50  137.16,10.16 90 top
R51  106.05,10.16 90 top
R52  140.97,19.05 270 top
R53  168.91,10.16 90 top
R54  170.18,35.24 270 top
R55  157.16,38.99 270 top
R56  170.18,38.99 270 top
R57  166.05,65.41 270 top
R58  169.86,53.98 180 top
R59  168.91,59.05 270 top
R60  165.74,53.02 270 top
R61  148.91,65.41 270 top
R62  148.91,77.79 270 top
R63  166.05,77.79 270 top
R64  147.96,81.28 270 top
R65  165.1,81.28 270 top
R66  29.84,95.63 90 top
R70  15.24,85.09 180 top
S1  89.53,12.7 0 top
S2  120.65,12.7 0 top
S3  145.73,12.7 0 top
TP1  37.47,47.62 0 top
TP2  37.47,50.8 0 top
TP3  160.97,34.35 90 top
TP4  174.31,34.35 90 top
X1  8.89,7.62 180 top
X2  152.08,91.19 0 top
X3  34.29,7.62 180 top
X4  169.23,90.81 0 top
X5  35.56,85.72 0 top
X6  15.24,96.52 180 top
X7  35.56,96.52 0 top

### Tracks (layer width: path | path; a pad name or v marks a point on that pad's centre or on a via)
+15V  (via drill 0.5)
  Top 0.406: IC4.7 C60.1 C65.1 v8.26,57.78 | IC2.7 C63.1 C67.1 v22.23,57.78 22.23,49.15 21.94,48.86 | C93.2 X6.1 | IC6.7 10.16,18.92 10.79,18.29 C69.1 14.99,17.53 17.78,20.32 17.78,25.97 | IC1.7 C59.1 17.78,48.51 | C93.2 21.97,76.45 v22.23,76.2 | 21.94,48.86 21.59,48.51 17.78,48.51 | 17.78,25.97 17.78,48.51 | C53.1 C57.1 IC7.7 v28.57,26.04 17.84,26.04 17.78,25.97 | C50.1 C55.1 IC8.7 v40.01,26.04 | IC9.7 C49.1 25.97,44.83 21.94,48.86 | IC5.7 C45.1 v80.39,31.37 | IC12.7 C41.1 v145.8,31.43 | IC11.7 C42.1 v110.24,31.43 | IC10.7 C47.1 v61.98,31.37 | C39.1 147,63.94 147.32,63.63 IC13.7 v147.32,59.94 | C33.1 C34.1 | C33.1 147.13,76.83 147.64,76.33 IC17.7 v147.64,72.39 | D5.C 142.25,79.37 142.88,78.74 144.02,78.74 144.72,78.04 C33.1 | C94.1 IC14.7 155.26,30.35 154.75,29.84 153.03,29.84 152.08,30.8 v152.08,31.43 | C3.1 IC15.7 168.28,30.42 167.64,29.78 166.43,29.78 v164.78,31.43 | C31.1 164.15,63.82 164.47,63.5 IC16.7 v164.47,59.37 162.88,59.37 161.93,58.42 161.93,48.26 v163.19,46.99 | C26.1 164.21,76.83 164.78,76.26 IC3.7 v164.78,72.39 | C26.1 C25.1 | C26.1 161.86,78.17 161.29,78.74 159.96,78.74 159.38,79.31 D7.C | X5.1 C7.1 C8.1 X7.1 R66.2 28.57,96.52 27.3,97.79 22.42,97.79 21.97,97.35 C93.2
  Bottom 0.406: v8.26,57.78 v22.23,57.78 v22.23,76.2 | v28.57,26.04 v40.01,26.04 45.34,31.37 v61.98,31.37 v80.39,31.37 80.45,31.43 v110.24,31.43 v145.8,31.43 v152.08,31.43 v164.78,31.43 163.19,33.02 v163.19,46.99 | v147.32,59.94 147.64,60.26 v147.64,72.39 v164.78,72.39 164.78,59.69 v164.47,59.37
+GATE
  Top 0.406: R64.1 C5.2 D13.C 151.38,85.15 152.08,85.85 X2.1
+SOURCE
  Top 0.406: 154.62,88.63 154.62,86.74 154.17,86.29 D13.A 156.21,85.15 157.54,83.82 157.54,56.52 155.57,54.55 R6.1 | 154.62,88.63 X2.4 | 154.62,93.73 X2.3 | 149.54,93.73 X2.2 | 154.62,88.63 154.62,93.73 | 154.62,93.73 149.54,93.73 | 149.54,93.73 149.54,88.65 X2.5
+VBIAS
  Top 0.406: IC14.2 155.26,28.57 156.53,29.84 IC14.6 156.53,33.08 157.16,33.72 R10.2 TP3.P$1
-10V
  Top 0.406: C1.2 162.22,6.1 D2.2 162.24,5.99 R7.2 | R7.2 160.53,4.38 159.32,3.17 R9.E | R53.E 166.31,3.17 165.1,4.38 R7.2
-15V  (via drill 0.5)
  Top 0.406: X6.4 C92.2 v8.51,80.64 8.51,76.83 v4.06,72.39 C62.2 | C64.2 C68.2 18.16,60.45 15.88,58.17 C61.2 IC1.4 | IC2.4 18.22,71.18 C64.2 | IC4.4 4.12,71.18 C62.2 | C62.2 C66.2 4.06,67.31 3.81,67.06 v3.81,35.18 3.81,29.21 4.57,28.45 C70.2 6.99,27.69 7.62,27.05 IC6.4 v7.62,22.54 | C64.2 v18.16,72.39 | C52.2 C56.2 IC8.4 v44.13,22.8 49.09,22.8 52.32,26.04 C48.2 IC10.4 54.55,25.4 v54.55,25.08 | IC7.4 32.57,22.8 32.77,22.61 | 32.77,22.61 C54.2 C58.2 | v33.97,23.11 33.27,23.11 32.77,22.61 | IC9.4 C51.2 v33.97,35.18 | 70.93,27.24 IC5.4 70.99,27.3 70.93,27.24 | 70.93,27.24 70.36,26.67 69.6,26.67 | 69.6,26.67 C46.2 69.47,26.54 | IC11.4 100.71,27.3 100.08,26.67 C44.2 v99.31,25.08 | IC12.4 C43.2 v136.14,25.72 | R46.2 v95.89,30.48 | 69.6,26.67 69.47,26.54 | 69.47,26.54 v69.47,25.08 | C36.2 150.25,69.22 IC17.4 | C36.2 C35.2 152.15,63.75 156.21,59.69 v156.21,58.1 156.21,56.52 155.57,55.88 151.89,55.88 151.51,56.26 C40.2 151.45,57.09 IC13.4 | D6.A 155.57,73.91 | 155.57,73.91 152.15,70.48 C36.2 | IC14.4 C96.2 v159.38,24.07 | C95.2 IC15.4 v172.08,26.61 v172.09,26.61 | IC14.4 v159.38,26.61 IC14.4 | C32.2 IC16.4 168.91,56.45 168.91,55.63 169.29,55.24 172.72,55.24 173.35,55.88 v173.35,58.1 | IC3.4 168.96,69.14 C28.2 | C28.2 C27.2 | D8.A 172.72,74.54 171.7,73.53 | 171.7,73.53 168.97,70.8 C28.2 | 155.57,73.91 v156.52,73.91 v156.53,73.91 | v170.18,75.12 170.18,75.06 171.7,73.53 | R7.1 v160.97,2.6 | D14.C X7.3 C24.2 C9.2 X5.3 38.1,83.19 v35.56,80.64
  Bottom 0.406: v18.16,72.39 v4.06,72.39 | v7.62,22.54 33.4,22.54 v33.97,23.11 43.81,23.11 v44.13,22.8 | v33.97,35.18 v3.81,35.18 | v54.55,25.08 v69.47,25.08 v99.31,25.08 | v99.31,25.08 99.95,25.72 v136.14,25.72 137.03,26.61 v159.38,26.61 v172.09,26.61 v172.08,26.61 172.08,52.07 173.35,53.34 v173.35,58.1 v156.21,58.1 | v95.89,30.48 95.89,28.51 v99.31,25.08 | v156.53,73.91 156.72,73.91 157.92,75.12 v170.18,75.12 | v159.38,24.07 159.38,4.19 v160.97,2.6 | v35.56,80.64 v8.51,80.64
-GATE
  Top 0.406: R65.1 C6.2 D12.C 168.47,85.09 169.23,85.85 X4.1
-SOURCE
  Top 0.406: 171.77,88.25 171.77,86.49 171.31,86.03 D12.A 173.35,85.09 174.62,83.82 174.62,55.88 172.72,53.98 R58.1 | 171.77,88.25 X4.4 | X4.5 X4.2 X4.3 171.77,93.34 171.77,88.25
-VBIAS
  Top 0.406: IC15.2 168.28,28.57 169.54,29.84 IC15.6 169.54,33.08 170.18,33.72 R54.2 TP4.P$1
GND  (via drill 0.5)
  Top 0.406: C67.2 C63.2 v25.4,61.59 | C65.2 C60.2 v11.43,61.59 | C93.1 v25.4,96.52 | C92.1 v5.08,96.52 | C11.2 R17.1 v10.16,78.74 | C10.2 R16.1 v20.32,78.74 | C64.1 C68.1 v16.38,67.94 | C69.2 10.79,13.46 X1.2 | C70.1 v5.71,30.23 | IC6.2 v10.16,23.5 | C62.1 C66.1 v2.29,67.94 | C59.2 v15.88,45.09 | R24.1 v11.43,48.26 | C61.1 v13.34,61.59 | C91.2 C90.2 C89.2 C88.2 C87.2 C86.2 C85.2 C84.2 C83.2 C71.2 C22.2 130.3,21.84 131.13,21.02 S2.1 | C16.2 R31.1 v29.21,15.56 | R32.1 C17.2 v42.55,17.4 C56.1 C52.1 | C53.2 C57.2 v25.4,32.38 | C50.2 C55.2 v36.83,32.38 35.75,32.38 35.56,32.58 C51.1 | C58.1 C54.1 v35.88,21.59 | R39.1 v37.47,44.13 | C49.2 v33.02,47.94 | IC10.3 v56.52,28.57 | C47.2 v65.09,29.84 | C48.1 v49.21,27.3 | C46.1 v66.36,26.67 | C45.2 v83.5,29.84 | C44.1 v95.89,26.67 | C42.2 v113.35,29.84 | C41.2 v149.22,29.84 | C43.1 v133.03,27.3 | C23.2 v140.97,25.4 | TP2.P$1 v37.47,53.02 | R4.2 R5.2 v150.5,51.37 | C39.2 v145.73,66.29 | C36.1 C35.1 v153.92,65.72 | C1.1 162.22,7.87 D2.1 162.29,9.51 v162.31,9.53 | C2.1 v151.76,5.08 | C4.1 v172.72,5.08 | C96.1 v157.8,20.95 | C95.1 v170.81,20.95 | C94.2 v155.26,37.47 | C3.2 v168.28,37.47 | C31.2 v162.81,66.29 | C40.1 v154.62,57.15 | C32.1 v172.09,56.45 | C28.1 C27.1 v170.75,66.04 | C25.2 C26.2 v160.08,73.66 | C33.2 C34.2 v142.94,73.72 | R18.2 v41.27,90.17 | D9.C v29.84,90.17 | X7.2 35.56,92.33 | 35.56,92.33 X5.2 | 35.56,92.33 C8.2 C7.2 C9.1 | C24.1 35.56,92.33
  pour Bottom: 1.27,1.27 1.27,100.33 176.53,100.33 176.53,1.27
N$1
  Top 0.406: R44.1 74.3,16.51 74.93,15.88 R1.A 76.2,9.53 74.93,8.26 R1.S
N$2
  Top 0.406: R2.1 148.59,50.55 148.34,50.8 D1.A R3.2
N$3
  Top 0.406: R10.1 R55.2 JP1.1
N$4
  Top 0.406: R60.2 D4.C
N$5
  Top 0.406: IC13.3 R4.1 R5.1 R6.2
N$7
  Top 0.406: C14.1 R21.2 22.61,69.47 22.23,69.85 IC2.2 22.23,73.03 20.95,74.3 R13.2
N$8
  Top 0.406: R70.1 19.05,82.3 18.67,81.92 R14.1
N$9
  Top 0.406: R8.2 147.57,58.86 147.32,58.61 IC13.2 147.32,55.88 146.69,55.24 R3.1 145.48,54.55 144.78,53.85 144.78,45.72 146.69,43.81 155.57,43.81 157.16,42.23 R55.1
N$12
  Top 0.406: R9.S C2.2 151.76,18.73 156.53,23.5 IC14.3
N$13
  Top 0.406: R70.4 11.43,82.3 11.81,81.92 R15.2
N$15
  Top 0.406: C15.1 R22.2 8.51,69.47 8.26,69.72 IC4.2 8.26,73.03 9.53,74.3 R13.1
N$16
  Top 0.406: IC4.8 9.53,64.52 9.14,64.14 C12.1
N$17
  Top 0.406: C15.2 R22.1 7.24,67.69 6.99,67.44 IC4.6 6.99,64.52 7.37,64.14 C12.2 7.37,62.61 6.35,61.59 6.35,56.52 7.37,55.5 R20.2
N$18
  Top 0.406: IC2.8 23.5,64.52 23.11,64.14 C13.1
N$19
  Top 0.406: C14.2 R21.1 21.21,67.69 20.95,67.44 IC2.6 20.95,64.52 21.34,64.14 C13.2 21.34,62.61 20.32,61.59 R19.2
N$20
  Top 0.406: R23.2 R19.1 16.38,53.72 15.88,54.23 IC1.2
N$21
  Top 0.406: IC1.3 14.61,54.36 13.97,53.72 R20.1 R24.2
N$22  (via drill 0.5)
  Top 0.406: R23.1 19.3,49.91 18.41,50.8 18.41,52.07 17.78,52.7 15.24,52.7 14.61,52.07 IC1.6 14.61,46.35 8.89,40.64 v8.89,36.83 R25.2 | R40.2 48.9,31.75 v43.81,36.83
  Bottom 0.406: v43.81,36.83 v8.89,36.83
N$23
  Top 0.406: R25.1 IC6.3
N$24
  Top 0.406: IC6.6 R27.2
N$25
  Top 0.406: R27.1 X1.1
N$26
  Top 0.406: IC7.2 28.57,24.19 28.89,24.51 R36.2 C20.1 R28.2
N$27
  Top 0.406: R31.2 C16.1 | C16.1 R29.2 | C16.1 32.32,18.48 31.75,19.05 30.42,19.05 29.84,19.62 IC7.3
N$28
  Top 0.406: C17.1 R32.2 | R30.1 C17.1 | C17.1 38.8,18.48 39.37,19.05 40.64,19.05 41.27,19.68 IC8.3
N$29
  Top 0.406: R29.1 X3.1
N$30
  Top 0.406: R30.2 X3.2
N$31
  Top 0.406: C21.1 R37.2 40.39,24.51 40.01,24.13 | IC8.2 40.01,24.13 | R28.1 37.85,26.29 40.01,24.13
N$32
  Top 0.406: IC8.8 38.73,29.27 39.12,29.65 C18.1
N$33
  Top 0.406: C21.2 R37.1 41.53,26.29 41.27,26.54 IC8.6 41.27,29.27 40.89,29.65 C18.2 41.59,30.48 41.91,30.8 41.91,35.56 41.34,36.13 38.1,36.13 37.47,36.77 R35.2
N$34
  Top 0.406: IC7.8 27.3,29.27 27.69,29.65 C19.1
N$35
  Top 0.406: C20.2 R36.1 30.16,26.29 29.84,26.61 IC7.6 29.84,29.34 29.46,29.72 C19.2 30.23,30.48 30.48,30.73 30.48,35.56 29.21,36.83 R34.2
N$36
  Top 0.406: IC9.2 33.02,39.05 32.7,39.37 R34.1 R38.2
N$37
  Top 0.406: IC9.3 34.29,38.99 34.61,39.31 R35.1 R39.2
N$38
  Top 0.406: R38.1 30.16,42.8 30.48,42.48 30.48,41.27 31.11,40.64 33.72,40.64 34.29,41.21 IC9.6 34.29,45.09 34.92,45.72 37.53,45.72 | R33.2 48.9,29.84 42.55,36.2 42.55,43.18 40.01,45.72 37.53,45.72 | TP1.P$1 37.47,45.78 37.53,45.72
N$39
  Top 0.406: R40.1 R33.1 IC10.2 57.15,29.84 57.78,29.21 57.78,21.59 57.15,20.95 R41.2
N$40
  Top 0.406: R46.1 R45.1 IC11.3
N$41
  Top 0.406: 61.02,28.57 IC10.6 61.47,28.57 | R0.3 61.59,4.45 62.87,5.71 62.87,13.97 62.23,14.61 R0.2 59.69,16.89 61.59,18.8 61.59,28.45 61.47,28.57 | R42.2 61.47,28.57
N$42
  Top 0.406: R42.1 IC5.3
N$43
  Top 0.406: IC5.2 73.85,29.78 74.3,29.34 R43.2
N$44
  Top 0.406: R43.1 R44.2 76.9,22.48 77.79,21.59 77.79,10.99 78.87,9.91 S1.13
N$45
  Top 0.406: R51.E 121.54,3.17 S2.13
N$46
  Top 0.406: IC11.2 103.5,29.84 104.14,29.21 104.14,26.99 103,25.84 R47.2
N$47
  Top 0.406: R48.2 R47.1 R49.2
N$48
  Top 0.406: IC11.6 109.22,28.57 109.86,27.94 109.86,25.4 | 109.86,25.4 109.22,24.77 R48.1 | 109.86,25.4 131.51,25.4 138.43,18.48 R50.A 135.89,13.34 R50.S
N$50
  Top 0.406: R49.1 104.78,15.88 | 104.78,15.88 R51.S | R51.A 104.78,15.88
N$51
  Top 0.406: R50.E 138.43,11.43 140.97,13.97 R52.2
N$52
  Top 0.406: C23.1 140.97,20.95 | 140.97,20.95 R52.1 | IC12.3 140.02,28.57 140.65,27.94 140.65,26.67 139.38,25.4 139.38,21.27 139.7,20.95 140.97,20.95
N$53
  Top 0.406: IC12.2 140.34,29.84 141.6,28.57 IC12.6 145.41,28.57 146.05,27.94 146.05,25.4 142.88,22.23 142.88,13.34 143.51,12.7 S3.1
N$54  (via drill 0.5)
  Top 0.406: D1.C 148.34,46.99 | 148.34,46.99 148.59,47.24 R2.2 | 148.34,46.99 146.62,46.99 146.62,45.78 147.32,45.09 150.3,45.09 | 150.3,45.09 165.29,45.09 165.74,45.53 D4.A | S3.2 146.69,16.51 150.5,20.32 v150.5,42.55 | v150.5,46.35 150.5,45.28 150.3,45.09
  Bottom 0.406: v150.5,42.55 v150.5,46.35
N$57
  Top 0.406: R53.S C4.2 172.72,17.21 169.54,20.38 IC15.3
N$59
  Top 0.406: R54.1 R56.2 JP2.1
N$60  (via drill 0.5)
  Top 0.406: R59.2 164.72,58.17 164.47,57.91 IC16.2 164.47,52.7 v163.83,52.07 | R56.1 170.18,48.9 v167.64,51.44
  Bottom 0.406: v167.64,51.44 164.47,51.44 v163.83,52.07
N$61
  Top 0.406: IC16.3 R60.1 165.8,53.98 R58.2
N$62
  Top 0.406: R59.1 165.93,59.94 165.74,60.13 IC16.6 165.74,63.5 166.05,63.82 R57.2
N$63
  Top 0.406: R66.1 D9.A
N$64
  Top 0.406: IC3.3 R57.1
N$65
  Top 0.406: R61.1 IC17.3
N$66
  Top 0.406: R61.2 148.91,63.88 148.59,63.56 IC13.6 148.59,60.9 148.84,60.64 R8.1
N$68
  Top 0.406: R62.2 IC17.6
N$69
  Top 0.406: R63.2 IC3.6
N$70
  Top 0.406: 148.91,80.39 R64.2 D5.A | 148.91,80.39 C5.1 D6.C | R62.1 148.91,80.39
N$73
  Top 0.406: 165.99,80.39 C6.1 D8.C | 165.99,80.39 R65.2 D7.A | R63.1 166.05,80.33 165.99,80.39
N$77
  Top 0.406: D14.A R18.1
N$78
  Top 0.406: C82.2 C81.2 | C81.2 C80.2 C79.2 C78.2 C77.2 C76.2 C75.2 C74.2 | C74.2 C73.2 C72.2 99.44,21.84 100.01,21.27 S1.1 | IC5.6 80.33,28.57 80.96,27.94 C81.2 | R45.2 95.19,28.57 94.3,27.69 C74.2
N$79
  Top 0.406: C72.1 S1.2
N$80
  Top 0.406: S1.3 C73.1
N$81
  Top 0.406: S1.4 C74.1
N$82
  Top 0.406: R41.1 57.15,10.16 57.78,9.53 R0.1
N$83
  Top 0.406: S1.5 C75.1
N$84
  Top 0.406: S1.6 C76.1
N$85
  Top 0.406: S1.7 C77.1
N$86
  Top 0.406: S1.8 C78.1
N$87
  Top 0.406: S1.9 C79.1
N$88
  Top 0.406: S1.10 C80.1
N$89
  Top 0.406: S1.11 C81.1
N$90
  Top 0.406: S1.12 C82.1
N$91
  Top 0.406: S2.2 C22.1
N$92
  Top 0.406: S2.3 C71.1
N$93
  Top 0.406: S2.4 C83.1
N$94
  Top 0.406: S2.5 C84.1
N$95
  Top 0.406: S2.6 121.6,20 C85.1
N$96
  Top 0.406: S2.7 C86.1
N$97
  Top 0.406: S2.8 C87.1
N$98
  Top 0.406: S2.9 C88.1
N$99
  Top 0.406: S2.10 C89.1
N$100
  Top 0.406: S2.11 C90.1
N$101
  Top 0.406: S2.12 C91.1
V+
  Top 0.406: X6.3 13.97,93.47 13.34,92.71 JP3.1 13.34,87.63 13.97,87 R70.3 13.97,82.17 13.59,81.79 R15.1 R17.2 C11.1 13.59,76.33 12.7,75.44 8.76,75.44 6.99,73.66 IC4.3
V-  (via drill 0.5)
  Top 0.406: X6.2 16.51,93.34 17.14,92.71 JP4.2 17.14,87.63 16.51,87 R70.2 16.51,82.3 16.89,81.92 R14.2 R16.2 C10.1 v15.75,76.83 | IC2.3 v20.95,68.96
  Bottom 0.406: v20.95,68.96 20.95,71.63 v15.75,76.83

### Text on the board
tPlace: + | - | +15V GND -15V | Hall sensor | Vgs (+) | Vgs (-) | sense resistor | + | - | +15V GND -15V | CCM_0008 / Coil Driver Controller / N. Fitch / May. 2017 | +Vbias | -Vbias | integral gain frequency adj. | lead frequency adj. | PI freq. adj. | current monitor | control | proportional gain adj. | lead span adj. | BW adj. | +Ibias adj. | -Ibias adj.